# EAGLE design Levelshifter (EAGLE 4.16)
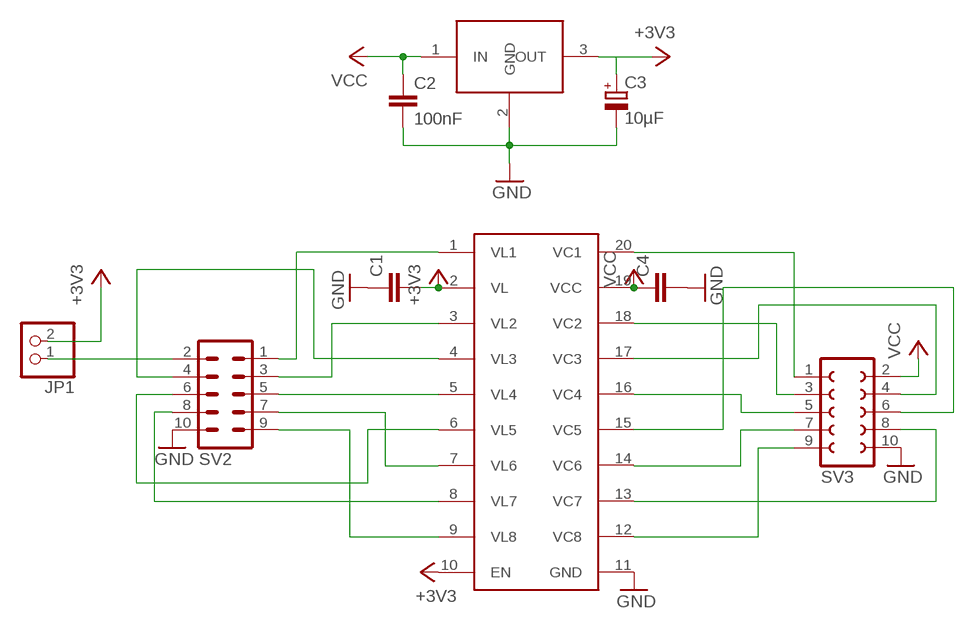
[diagram p0: schematic, sheet 1]

## Parts
C1  C-EUC0805  [C0805]
C2  100nF  C-EUC0805  [C0805]
C3  10µF  CPOL-EU153CLV-0405  [153CLV-0405]
C4  C-EUC0805  [C0805]
IC1  MAX3002  [TSSOP20]
JP1  PINHD-1X2  [1X02]
SV2  ML10L  [ML10L]
SV3  FE05-2W  [FE05-2W]
U$1  M2920  [SOT223]

## Nets
+3V3: C1.2 C3.+ IC1.2(VL) IC1.10(EN) JP1.2 U$1.3(OUT)
GND: C1.1 C2.2 C3.- C4.2 IC1.11(GND) SV2.10 SV3.10 U$1.2(GND)
N$1: IC1.20(VC1) SV3.1
N$2: IC1.18(VC2) SV3.3
N$3: IC1.17(VC3) SV3.4
N$4: IC1.16(VC4) SV3.5
N$5: IC1.15(VC5) SV3.6
N$6: IC1.14(VC6) SV3.7
N$7: IC1.13(VC7) SV3.8
N$8: IC1.12(VC8) SV3.9
N$9: IC1.1(VL1) SV2.1
N$10: IC1.3(VL2) SV2.3
N$11: IC1.4(VL3) SV2.4
N$12: IC1.5(VL4) SV2.5
N$13: IC1.7(VL6) SV2.7
N$14: IC1.6(VL5) SV2.6
N$15: IC1.8(VL7) SV2.8
N$16: IC1.9(VL8) SV2.9
N$17: JP1.1 SV2.2
VCC: C2.1 C4.1 IC1.19(VCC) SV3.2 U$1.1(IN)

## Library data of the parts
C1 C2 C4 = rcl:C-EU: CAPACITOR, European symbol
C3 = rcl:CPOL-EU: POLARIZED CAPACITOR, European symbol
IC1 = maxim-6b:MAX3002
JP1 = pinhead:PINHD-1X2: PIN HEADER
SV2 = con-harting-ml:ML10: HARTING
SV3 = con-lsta:FE05-2W: FEMALE HEADER
U$1 = v-reg:M2920

## Board
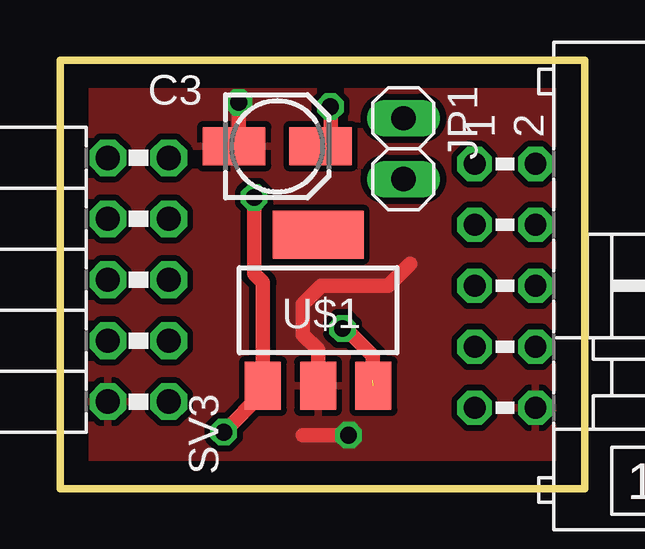
[diagram p1: board, top side]
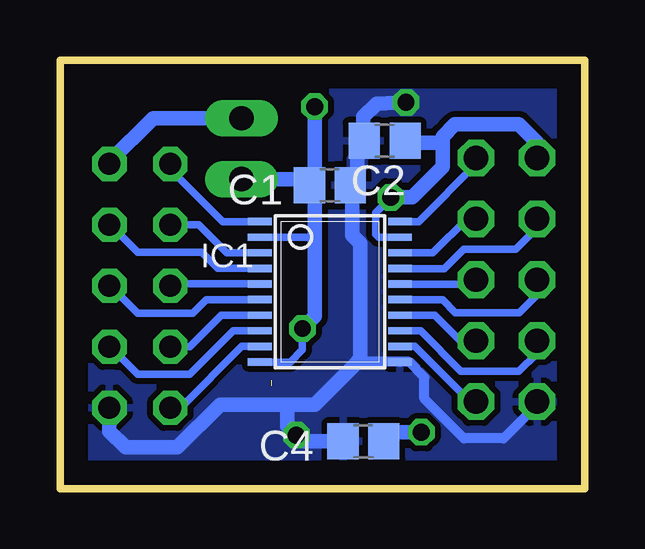
[diagram p2: board, bottom side, seen from below]

Size 21.87 x 17.87 mm. Coordinates in mm from the lower left corner, seen from the top.
Outline: 0,17.87 0,0 21.87,0 21.87,17.87 0,17.87
Copper layers (1*16): Top 0.035mm / dielectric 1.5mm / Bottom 0.035mm
Design rules "Bilex DRU": minimum track width 10mil, minimum drill 24mil, track to track 10mil, track to pad 10mil, pad to pad 10mil, via to via 10mil, smd to smd 10mil, copper to edge 40mil, drill to drill 8mil, minimum pad ring 10mil, minimum via ring 8mil, stop-mask expansion 4mil, vias tented up to drill 0mil, thermal gap 10mil

### Footprints (pad centres in the part's own frame; a part is rotated, then mirrored left to right if it is on the bottom)
C0805 = smd 1.3 x 1.5: 1 -0.85,0; 2 0.85,0
153CLV-0405 = smd 2.6 x 1.6: + 1.8,0; - -1.8,0
TSSOP20 = smd 0.305 x 0.991: 1 -2.925,-2.918; 2 -2.275,-2.918; 3 -1.625,-2.918; 4 -0.975,-2.918; 5 -0.325,-2.918; 6 0.325,-2.918; 7 0.975,-2.918; 8 1.625,-2.918; 9 2.275,-2.918; 10 2.925,-2.918; 11 2.925,2.918; 12 2.275,2.918; 13 1.625,2.918; 14 0.975,2.918; 15 0.325,2.918; 16 -0.325,2.918; 17 -0.975,2.918; 18 -1.625,2.918; 19 -2.275,2.918; 20 -2.925,2.918
1X02 = drill 1.016 long: 1 -1.27,0; 2 1.27,0
ML10L = drill 0.914 octagon: 1 -5.08,-1.27; 2 -5.08,1.27; 3 -2.54,-1.27; 4 -2.54,1.27; 5 0,-1.27; 6 0,1.27; 7 2.54,-1.27; 8 2.54,1.27; 9 5.08,-1.27; 10 5.08,1.27
FE05-2W = drill 1.016 octagon: 1 -5.08,1.27; 2 -5.08,-1.27; 3 -2.54,1.27; 4 -2.54,-1.27; 5 0,1.27; 6 0,-1.27; 7 2.54,1.27; 8 2.54,-1.27; 9 5.08,1.27; 10 5.08,-1.27
SOT223 = smd 1.5 x 2: 1 -2.3,-3.15; 2 0,-3.15; 3 2.3,-3.15 | smd 3.8 x 2: 4 0,3.15

### Placement (x,y rotation side)
C1  10.63,12.65 180 bottom
C2  8.34,14.51 180 bottom
C3  9.05,14.28 0 top
C4  9.23,1.98 180 bottom
IC1  10.63,8.21 270 bottom
JP1  14.31,14.18 270 top
SV2  18.54,8.46 270 top
SV3  3.26,8.71 270 top
U$1  10.75,7.45 0 top

### Tracks (layer width: path | path; a pad name or v marks a point on that pad's centre or on a via)
+3V3  (via drill 0.7)  (1 unrouted)
  Top 0.61: v11.77,6.68 11.9,6.68 13.04,5.54 13.04,4.52 13.05,4.51 | v11.26,15.93 11.29,15.8 11.29,14.83 10.85,14.4 C3.+
  Bottom 0.305: v11.77,6.68 11.77,5.79 12.28,5.29 13.68,5.29 13.67,5.29 IC1.10 | IC1.2 11.27,10.49 11.26,10.49
  Bottom 0.61: v11.77,6.68 11.26,7.19 11.26,10.49 11.26,12.52 | JP1.2 11.52,12.91 11.26,12.65 C1.2 11.22,12.56 11.26,12.52 | 11.26,12.52 v11.26,15.93
GND  (via drill 0.7)
  Top 0.61: v12.02,2.24 10.12,2.24 | U$1.2 10.75,5.79 10.12,6.43 10.12,7.7 10.88,8.46 13.68,8.46 14.59,9.37 | C3.- 7.25,14.38 7.45,14.58 v7.45,16.11
  Bottom 0.305: 12.41,2.62 v12.02,2.24 11.77,1.98 | SV3.10 2.12,3.38
  Bottom 0.406: 2.12,3.38 2.25,3.25 | 9.49,5.29 9.35,5.29 IC1.11 7.33,5.29 6.69,4.65 6.69,3.76 5.04,2.11 3.39,2.11 2.25,3.25 | 2.25,3.25 1.99,3.51
  Bottom 0.61: SV2.10 19.81,2.41 19.14,1.73 16.98,1.73 15.2,3.51 12.41,3.51 | 11.77,1.98 C4.2 | 12.41,3.51 12.41,2.62 | 9.49,5.29 9.49,5.28 11.26,3.51 12.41,3.51 | 9.35,5.29 9.35,10.23 9.69,10.57 9.69,12.6 9.76,12.68 9.78,12.66 C1.1 | C1.1 9.52,12.61 9.61,12.52 9.48,12.4 | v7.45,16.11 8.67,16.06 9.23,15.5 9.23,14.79 9.18,14.73 9.19,14.72 C2.2 9.19,14.47 9.48,14.18 9.48,13.16 9.78,12.87 C1.1
  pour Bottom: -0.04,17.73 21.8,17.73 21.8,0.08 -0.01,0.03
  pour Top: -0.04,17.76 21.8,17.76 21.8,0.08 -0.01,0.08
N$1
  Bottom 0.305: 6.93,11.14 IC1.20 | 6.93,11.14 6.94,11.13 | SV3.1 4.53,13.54 6.93,11.14
N$2
  Bottom 0.305: IC1.18 7.72,9.84 7.73,9.83 6.33,9.83 4.91,11.25 SV3.3
N$3
  Bottom 0.305: IC1.17 7.87,9.19 7.88,9.17 5.85,9.17 5.04,9.98 2.88,9.98 1.99,10.87 SV3.4
N$4
  Bottom 0.305: IC1.16 7.73,8.54 5.12,8.54 5.04,8.46 SV3.5
N$5
  Bottom 0.305: IC1.15 7.74,7.89 7.76,7.88 5.93,7.88 5.4,7.34 2.73,7.34 1.99,8.08 SV3.6
N$6
  Bottom 0.305: 7.73,7.24 IC1.14 7.78,7.24 6.26,7.24 5.04,6.02 5.04,5.92 SV3.7
N$7
  Bottom 0.305: IC1.13 7.61,6.59 7.61,6.58 6.84,6.58 5.17,4.91 2.75,4.91 2.02,5.64 1.99,5.64 SV3.8
N$8
  Bottom 0.305: IC1.12 7.09,5.94 4.79,3.63 SV3.9
N$9
  Bottom 0.305: SV2.1 17.27,13.33 15.09,11.14 IC1.1
N$10
  Bottom 0.305: IC1.3 14.93,9.84 16.09,11 SV2.3
N$11
  Bottom 0.305: IC1.4 15.29,9.19 15.96,9.86 18.63,9.86 19.77,11 SV2.4
N$12
  Bottom 0.305: SV2.5 17.23,8.46 17.15,8.54 IC1.5
N$13
  Bottom 0.305: IC1.7 15.15,7.24 16.47,5.92 SV2.7 17.36,5.92
N$14
  Bottom 0.305: IC1.6 15.77,7.89 16.34,7.32 18.63,7.32 19.77,8.46 SV2.6
N$15
  Bottom 0.305: IC1.8 14.66,6.59 16.47,4.78 18.63,4.78 19.77,5.92 SV2.8
N$16
  Bottom 0.305: IC1.9 14.29,5.94 16.85,3.38 SV2.9
N$17
  Bottom 0.61: SV2.2 19.81,13.63 17.99,15.45 JP1.1
VCC  (via drill 0.7)
  Top 0.61: v6.82,2.37 8.45,4 U$1.1 8.45,8.6 8.09,8.97 v8.09,12.14
  Bottom 0.305: IC1.19 8.59,10.49 8.72,10.62 8.72,11.51 v8.09,12.14
  Bottom 0.61: C4.1 8.38,2.07 8.09,2.37 v6.82,2.37 | SV3.2 1.99,14.43 2.75,15.19 5.42,15.19 5.93,14.68 5.93,14.43 | v8.09,12.14 7.2,12.14 5.93,13.41 5.93,14.18 5.93,14.43 | C2.1 7.5,14.51 7.58,14.43 5.93,14.43